# EAGLE design Science-Board (EAGLE 6.5.0)
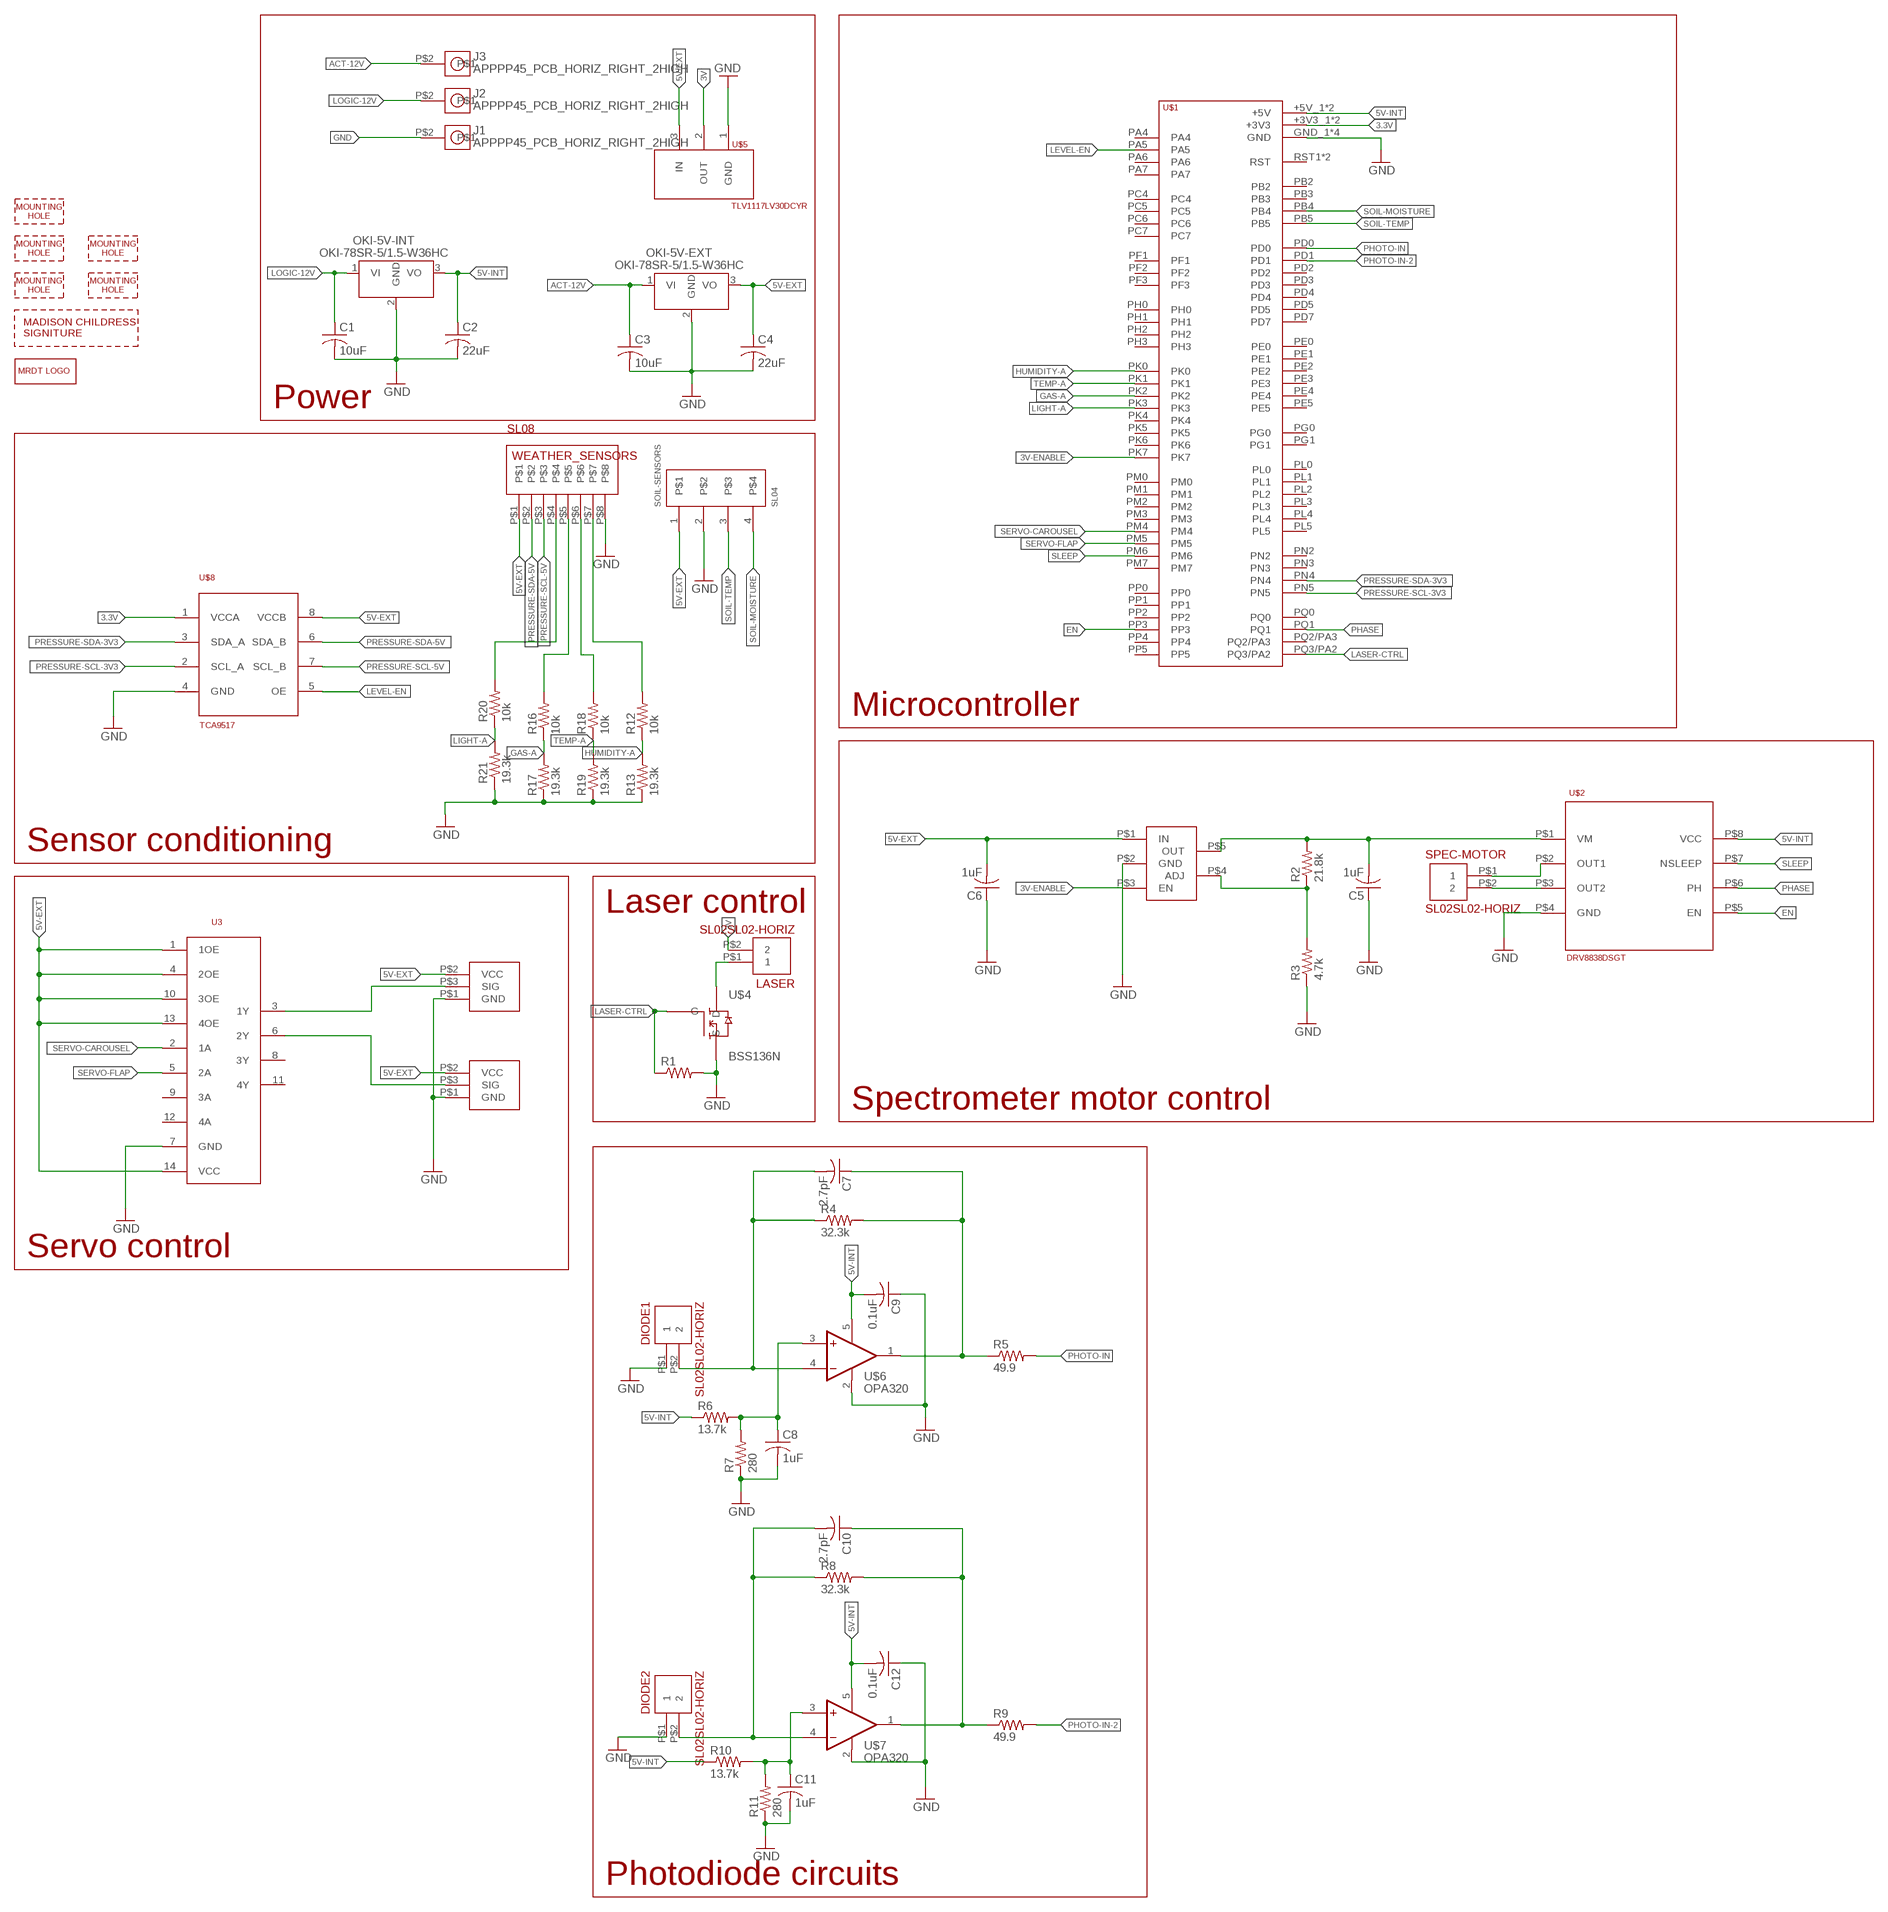
[diagram p0: schematic, sheet 1]

## Parts
C1  10uF  C-USC1206  [C1206]
C2  22uF  C-USC1206  [C1206]
C3  10uF  C-USC1206  [C1206]
C4  22uF  C-USC1206  [C1206]
C5  1uF  C-USC0805  [C0805]
C6  1uF  C-USC0805  [C0805]
C7  2.7pF  C-USC0805  [C0805]
C8  1uF  C-USC0805  [C0805]
C9  0.1uF  C-USC0805  [C0805]
C10  2.7pF  C-USC0805  [C0805]
C11  1uF  C-USC0805  [C0805]
C12  0.1uF  C-USC0805  [C0805]
CAROUSEL  SERVOHORIZ  [78208-103HLF]
DIODE1  SL02SL02-HORIZ  [MOLEX-70551-0001]
DIODE2  SL02SL02-HORIZ  [MOLEX-70551-0001]
FLAP  SERVOHORIZ  [78208-103HLF]
H1  MOUNTING_HOLE#6  [#6_SCREW]
H2  MOUNTING_HOLE#6  [#6_SCREW]
H3  MOUNTING_HOLE#6  [#6_SCREW]
H4  MOUNTING_HOLE#6  [#6_SCREW]
H5  MOUNTING_HOLE#6  [#6_SCREW]
J1  APPPP45_PCB_HORIZ_RIGHT_2HIGH  [APP45_PCB_HORIZ_RIGHT_2HIGH]
J2  APPPP45_PCB_HORIZ_RIGHT_2HIGH  [APP45_PCB_HORIZ_RIGHT_2HIGH]
J3  APPPP45_PCB_HORIZ_RIGHT_2HIGH  [APP45_PCB_HORIZ_RIGHT_2HIGH]
LASER  SL02SL02-HORIZ  [MOLEX-70551-0001]
LOGO1  MRDT_LOGO  [MRDT_LOGO]
OKI-5V-EXT  OKI-78SR-5/1.5-W36HC  [OKI-78SR_HORIZ]
OKI-5V-INT  OKI-78SR-5/1.5-W36HC  [OKI-78SR_HORIZ]
R1  R-US_M0805  [M0805]
R2  21.8k  R-US_M0805  [M0805]
R3  4.7k  R-US_M0805  [M0805]
R4  32.3k  R-US_M0805  [M0805]
R5  49.9  R-US_M0805  [M0805]
R6  13.7k  R-US_M0805  [M0805]
R7  280  R-US_M0805  [M0805]
R8  32.3k  R-US_M0805  [M0805]
R9  49.9  R-US_M0805  [M0805]
R10  13.7k  R-US_M0805  [M0805]
R11  280  R-US_M0805  [M0805]
R12  10k  R-US_R0805  [R0805]
R13  19.3k  R-US_R0805  [R0805]
R16  10k  R-US_R0805  [R0805]
R17  19.3k  R-US_R0805  [R0805]
R18  10k  R-US_R0805  [R0805]
R19  19.3k  R-US_R0805  [R0805]
R20  10k  R-US_R0805  [R0805]
R21  19.3k  R-US_R0805  [R0805]
SOIL-SENSORS  SL04  [MOLEX_SL_04_TH]
SPEC-MOTOR  SL02SL02-HORIZ  [MOLEX-70551-0001]
U3  SN74AHCT125  [SOIC14]
U$1  TIVA-1294  [TIVA-C-CONNECTED]
U$2  DRV8838DSGT  [8-WFDFN]
U$3  AP7365-WG-7DICT-ND  [SOT-25]
U$4  BSS136N  [PG-SOT23-3]
U$5  TLV1117LV30DCYR  [TO-243AA]
U$6  OPA320  [SOT-23-5]
U$7  OPA320  [SOT-23-5]
U$8  TCA9517  [SOIC8]
U$9  MADISON-CHILDRESS  [MADISON-CHLDRESS-SIG]
WEATHER_SENSORS  SL08  [MOLEX-70551-0007]

## Nets
3.3V: U$1.+3V3_1(+3V3) U$1.+3V3_2(+3V3) U$8.1(VCCA)
3V: LASER.P$2 U$5.2(OUT)
3V-ENABLE: U$1.PK7 U$3.P$3(EN)
5V-EXT: C4.1 C6.2 CAROUSEL.P$2(VCC) FLAP.P$2(VCC) OKI-5V-EXT.3(VO) SOIL-SENSORS.1 U3.1(1OE) U3.4(2OE) U3.10(3OE) U3.13(4OE) U3.14(VCC) U$3.P$1(IN) U$5.3(IN) U$8.8(VCCB) WEATHER_SENSORS.P$1
5V-INT: C2.1 C9.2 C12.2 OKI-5V-INT.3(VO) R6.1 R10.1 U$1.+5V_1(+5V) U$1.+5V_2(+5V) U$2.P$8(VCC) U$6.5(OFF1) U$7.5(OFF1)
ACT-12V: C3.1 J3.P$2 OKI-5V-EXT.1(VI)
EN: U$1.PP3 U$2.P$5(EN)
GAS-A: R16.1 R17.2 U$1.PK2
GND: C1.2 C2.2 C3.2 C4.2 C5.1 C6.1 C8.2 C9.1 C11.2 C12.1 CAROUSEL.P$1(GND) DIODE1.P$1 DIODE2.P$1 FLAP.P$1(GND) J1.P$2 OKI-5V-EXT.2(GND) OKI-5V-INT.2(GND) R1.2 R3.1 R7.1 R11.1 R13.1 R17.1 R19.1 R21.1 SOIL-SENSORS.2 U3.7(GND) U$1.GND_1(GND) U$1.GND_2(GND) U$1.GND_3(GND) U$1.GND_4(GND) U$2.P$4(GND) U$3.P$2(GND) U$4.P$2(S) U$5.1(GND) U$6.2(OFF2) U$7.2(OFF2) U$8.4(GND) WEATHER_SENSORS.P$8
HUMIDITY-A: R12.1 R13.2 U$1.PK0
LASER-CTRL: R1.1 U$1.PQ3/PA2 U$4.P$3(G)
LEVEL-EN: U$1.PA5 U$8.5(OE)
LIGHT-A: R20.1 R21.2 U$1.PK3
LOGIC-12V: C1.1 J2.P$2 OKI-5V-INT.1(VI)
N$1: SPEC-MOTOR.P$1 U$2.P$2(OUT1)
N$2: SPEC-MOTOR.P$2 U$2.P$3(OUT2)
N$3: LASER.P$1 U$4.P$1(D)
N$4: C7.2 DIODE1.P$2 R4.1 U$6.4(-IN)
N$5: C5.2 R2.2 U$2.P$1(VM) U$3.P$5(OUT)
N$7: R12.2 WEATHER_SENSORS.P$7
N$8: C7.1 R4.2 R5.1 U$6.1(OUT)
N$9: C10.2 DIODE2.P$2 R8.1 U$7.4(-IN)
N$10: C8.1 R6.2 R7.2 U$6.3(+IN)
N$11: CAROUSEL.P$3(SIG) U3.3(1Y)
N$12: FLAP.P$3(SIG) U3.6(2Y)
N$13: C10.1 R8.2 R9.1 U$7.1(OUT)
N$14: C11.1 R10.2 R11.2 U$7.3(+IN)
N$15: R20.2 WEATHER_SENSORS.P$4
N$16: R18.2 WEATHER_SENSORS.P$6
N$17: R16.2 WEATHER_SENSORS.P$5
N$18: R2.1 R3.2 U$3.P$4(ADJ)
PHASE: U$1.PQ1 U$2.P$6(PH)
PHOTO-IN: R5.2 U$1.PD0
PHOTO-IN-2: R9.2 U$1.PD1
PRESSURE-SCL-3V3: U$1.PN5 U$8.2(SCL_A)
PRESSURE-SCL-5V: U$8.7(SCL_B) WEATHER_SENSORS.P$3
PRESSURE-SDA-3V3: U$1.PN4 U$8.3(SDA_A)
PRESSURE-SDA-5V: U$8.6(SDA_B) WEATHER_SENSORS.P$2
SERVO-CAROUSEL: U3.2(1A) U$1.PM4
SERVO-FLAP: U3.5(2A) U$1.PM5
SLEEP: U$1.PM6 U$2.P$7(NSLEEP)
SOIL-MOISTURE: SOIL-SENSORS.4 U$1.PB4
SOIL-TEMP: SOIL-SENSORS.3 U$1.PB5
TEMP-A: R18.1 R19.2 U$1.PK1
Unconnected: U3.8(3Y) U3.9(3A) U3.11(4Y) U3.12(4A) U$1.PA4 U$1.PA6 U$1.PA7 U$1.PB2 U$1.PB3 U$1.PC4 U$1.PC5 U$1.PC6 U$1.PC7 U$1.PD2 U$1.PD3 U$1.PD4 U$1.PD5 U$1.PD7 U$1.PE0 U$1.PE1 U$1.PE2 U$1.PE3 U$1.PE4 U$1.PE5 U$1.PF1 U$1.PF2 U$1.PF3 U$1.PG0 U$1.PG1 U$1.PH0 U$1.PH1 U$1.PH2 U$1.PH3 U$1.PK4 U$1.PK5 U$1.PK6 U$1.PL0 U$1.PL1 U$1.PL2 U$1.PL3 U$1.PL4 U$1.PL5 U$1.PM0 U$1.PM1 U$1.PM2 U$1.PM3 U$1.PM7 U$1.PN2 U$1.PN3 U$1.PP0 U$1.PP1 U$1.PP2 U$1.PP4 U$1.PP5 U$1.PQ0 U$1.PQ2/PA3 U$1.RST1(RST) U$1.RST_2(RST)

## Notes on the sheet
- Power
- Microcontroller
- Sensor conditioning
- Laser control
- Spectrometer motor control
- Servo control
- Photodiode circuits

## Library data of the parts
C1-C12 = rcl:C-US: CAPACITOR, American symbol
CAROUSEL FLAP = MRDT-Connectors:SERVO
DIODE1 DIODE2 LASER SPEC-MOTOR = MRDT-Connectors:SL02
H1-H5 = MRDT-Hardware:MOUNTING_HOLE: Mounting hole for M6 bolt. Standard use mounting hole for: Tiva C Connected - M6 Anderson Powerpole Mounting Wing - M8 Most frame-mounted PCB's - M8
J1-J3 = MRDT-Connectors:APP: http://www.powerwerx.com/anderson-powerpoles/
LOGO1 = MRDT-Hardware:MRDT_LOGO
OKI-5V-EXT OKI-5V-INT = MRDT-ICs:OKI-78SR-*/1.5-W36?C: 4.95W DC/DC Converter Manufacturer: Murata; VOUT: +5v
R1-R13 R16-R21 = rcl:R-US_: RESISTOR, American symbol
SOIL-SENSORS = MRDT-Connectors:SL04
U3 = MRDT-ICs:SN74AHCT125: part # SN74AHCT125 QUADRUPLE BUS BUFFER GATES WITH 3-STATE OUTPUTS http://www.digikey.com/product-detail/en/SN74AHCT125DR/296-4652-1-ND/405208; PARTNO: SN74AHCT125
U$1 = MRDT-Microcontrollers:TIVA-1294: TIVA C CONNECTED LAUNCHPAD
U$2 = MRDT-ICs:DRV8838DSGT
U$3 = MRDT-ICs:AP7365-WG-7DICT-ND: Linear Voltage Regulator IC Positive Adjustable 1 Output 0.8 V ~ 5 V 600mA SOT-25-5
U$4 = MRDT-Semiconductors:BSS136N: MOSFET-N-CH 30V 1.4A SOT23
U$5 = MRDT-ICs:TLV1117LV30DCYR: Linear Voltage Regulator IC Positive Fixed 1 Output 3V 1A SOT-223-4
U$6 U$7 = MRDT-ICs:OPA320
U$8 = MRDT-ICs:TCA9517: TCA9517 Level-Shifting I2C Bus Repeater
U$9 = sig:MADISON-CHILDRESS
WEATHER_SENSORS = MRDT-Connectors:SL08

## Board
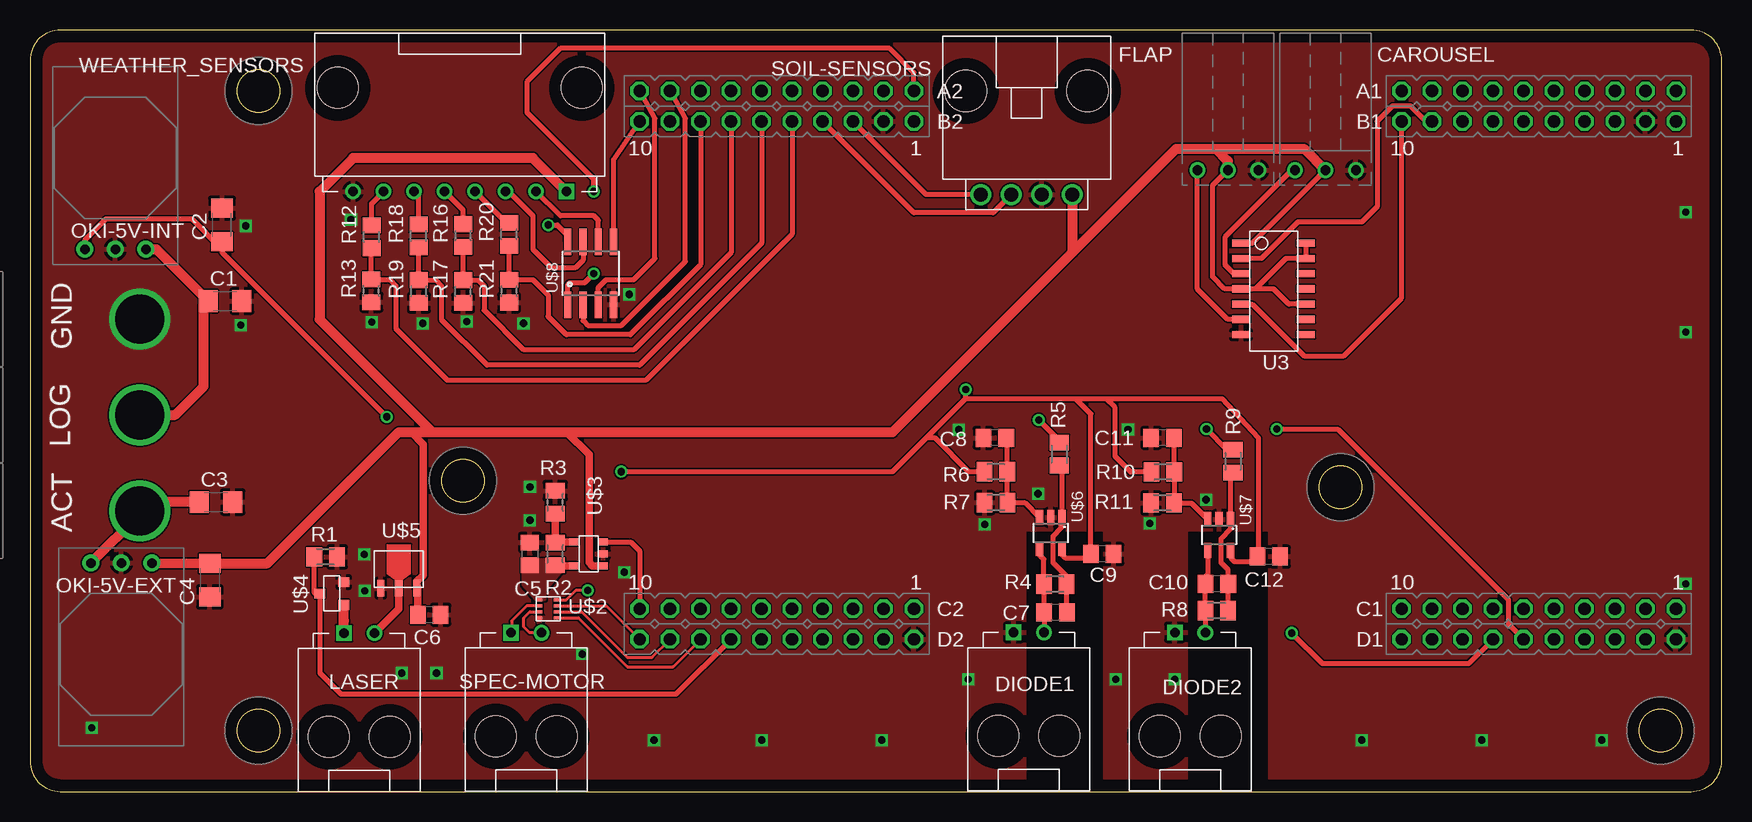
[diagram p1: board, top side]
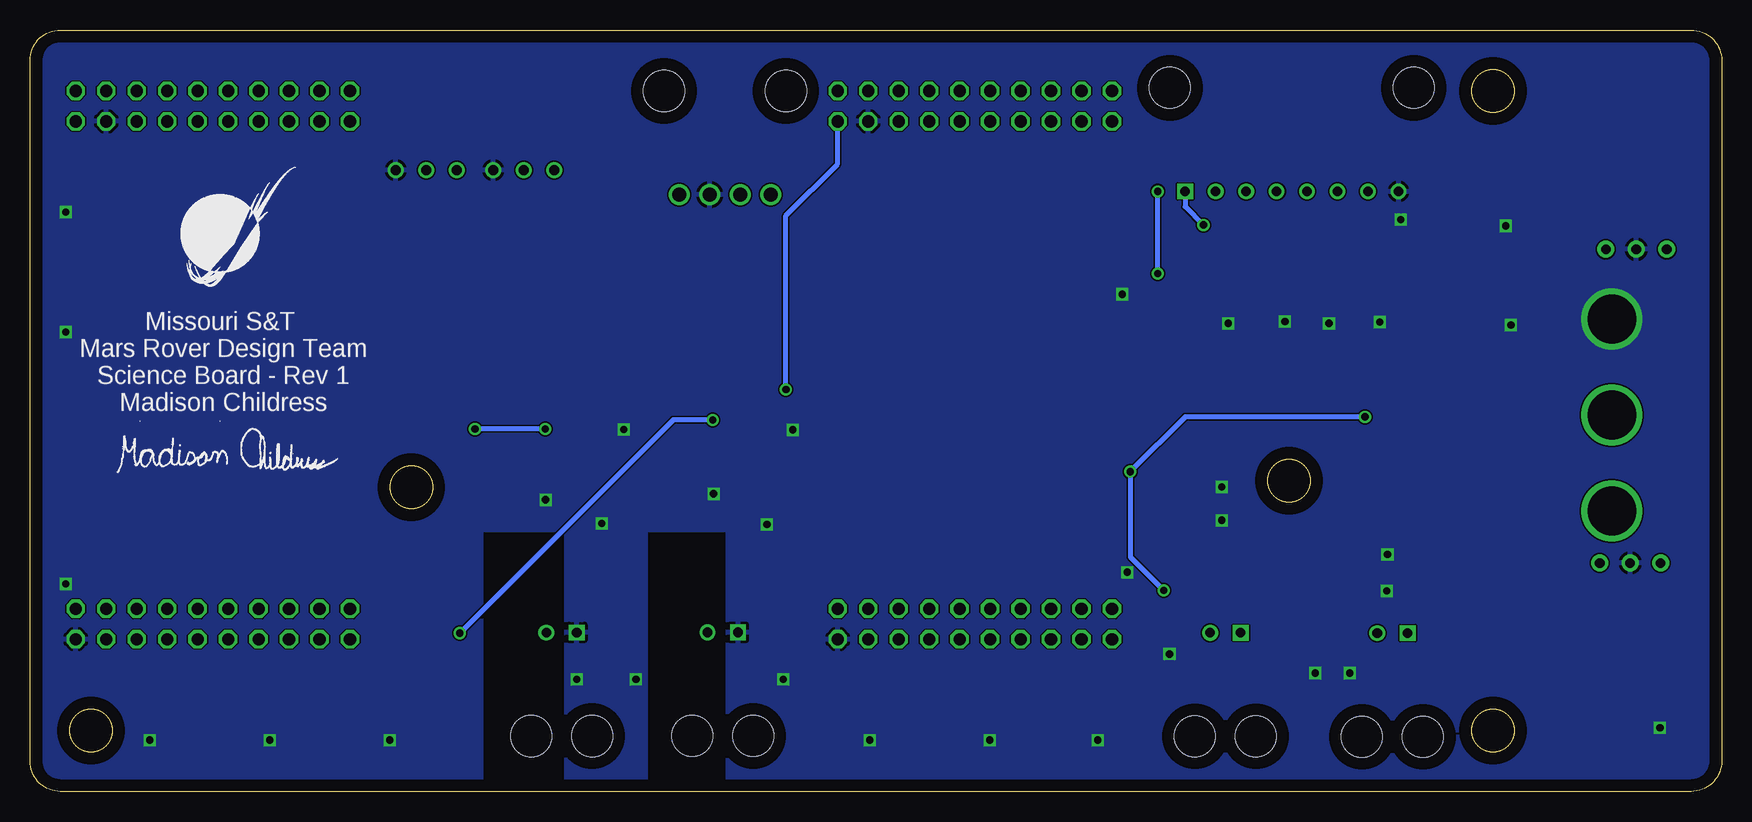
[diagram p2: board, bottom side, seen from below]

Size 140.97 x 63.5 mm. Coordinates in mm from the lower left corner, seen from the top.
Outline: 0,2.54 arc90 2.54,0 138.43,0 arc90 140.97,2.54 140.97,60.96 arc90 138.43,63.5 2.54,63.5 arc90 0,60.96 0,2.54
Copper layers (1*16): Top 0.035mm / dielectric 1.5mm / Bottom 0.035mm
Design rules "advanced_circuits_standard": minimum track width 5mil, minimum drill 10mil, track to track 5mil, track to pad 5mil, pad to pad 5mil, via to via 5mil, smd to smd 5mil, copper to edge 40mil, drill to drill 5mil, minimum pad ring 10mil, minimum via ring 8mil, stop-mask expansion 4mil, vias tented up to drill 0mil, thermal gap 10mil

### Footprints (pad centres in the part's own frame; a part is rotated, then mirrored left to right if it is on the bottom)
C1206 = smd 1.6 x 1.8: 1 -1.4,0; 2 1.4,0
C0805 = smd 1.3 x 1.5: 1 -0.95,0; 2 0.95,0
78208-103HLF = drill 0.8: P$1 2.54,0; P$2 0,0; P$3 -2.54,0
MOLEX-70551-0001 = drill 0.8 square: P$1 1.27,0 | drill 0.8: P$2 -1.27,0 | hole 3.404: 2.54,8.636; -2.54,8.636
APP45_PCB_HORIZ_RIGHT_2HIGH = drill 4.064: P$2 36.068,3.969
OKI-78SR_HORIZ = drill 0.8 pad 1.422: 1 0,0; 2 -2.54,0; 3 -5.08,0
M0805 = smd 1.3 x 1.6: 1 -0.95,0; 2 0.95,0
R0805 = smd 1.3 x 1.5: 1 -0.95,0; 2 0.95,0
MOLEX_SL_04_TH = drill 1.168: 1 3.81,0; 2 1.27,0; 3 -1.27,0; 4 -3.81,0 | hole 3.454: -5.08,8.636; 5.08,8.636
SOIC14 = smd 1.5 x 0.6: 1 1.11,10.16; 2 1.11,8.89; 3 1.11,7.62; 4 1.11,6.35; 5 1.11,5.08; 6 1.11,3.81; 7 1.11,2.54; 8 6.51,2.54; 9 6.51,3.81; 10 6.51,5.08; 11 6.51,6.35; 12 6.51,7.62; 13 6.51,8.89; 14 6.51,10.16
TIVA-C-CONNECTED = drill 1.016 octagon: +3V3_1 59.69,54.61; +3V3_2 123.19,54.61; +5V_1 59.69,52.07; +5V_2 123.19,52.07; GND_1 57.15,52.07; GND_2 59.69,8.89; GND_3 120.65,52.07; GND_4 123.19,8.89; PA4 39.37,52.07; PA5 36.83,52.07; PA6 105.41,52.07; PA7 52.07,8.89; PB2 102.87,54.61; PB3 100.33,54.61; PB4 54.61,52.07; PB5 52.07,52.07; PC4 118.11,54.61; PC5 115.57,54.61; PC6 113.03,54.61; PC7 105.41,54.61; PD0 107.95,8.89; PD1 110.49,8.89; PD2 57.15,54.61; PD3 107.95,54.61; PD4 49.53,54.61; PD5 46.99,54.61; PD7 107.95,52.07; PE0 118.11,52.07; PE1 115.57,52.07; PE2 113.03,52.07; PE3 110.49,52.07; PE4 120.65,54.61; PE5 110.49,54.61; PF1 123.19,11.43; PF2 120.65,11.43; PF3 118.11,11.43; PG0 115.57,11.43; PG1 59.69,11.43; PH0 44.45,11.43; PH1 41.91,11.43; PH2 118.11,8.89; PH3 115.57,8.89; PK0 49.53,52.07; PK1 46.99,52.07; PK2 44.45,52.07; PK3 41.91,52.07; PK4 57.15,11.43; PK5 54.61,11.43; PK6 39.37,11.43; PK7 36.83,11.43; PL0 107.95,11.43; PL1 105.41,11.43; PL2 102.87,11.43; PL3 100.33,11.43; PL4 113.03,11.43; PL5 110.49,11.43; PM0 52.07,11.43; PM1 49.53,11.43; PM2 46.99,11.43; PM3 120.65,8.89; PM4 102.87,52.07; PM5 100.33,52.07; PM6 36.83,8.89; PM7 57.15,8.89; PN2 105.41,8.89; PN3 102.87,8.89; PN4 36.83,54.61; PN5 39.37,54.61; PP0 54.61,54.61; PP1 52.07,54.61; PP2 100.33,8.89; PP3 41.91,8.89; PP4 41.91,54.61; PP5 54.61,8.89; PQ0 44.45,54.61; PQ1 39.37,8.89; PQ2/PA3 46.99,8.89; PQ3/PA2 44.45,8.89; RST1 49.53,8.89; RST_2 113.03,8.89
8-WFDFN = smd 0.25 x 0.5: P$1 0.75,0.725; P$2 0.25,0.725; P$3 -0.25,0.725; P$4 -0.75,0.725; P$5 -0.75,-0.725; P$6 -0.25,-0.725; P$7 0.25,-0.725; P$8 0.75,-0.725
SOT-25 = smd 0.55 x 0.8: P$1 1,1.2; P$2 0,1.2; P$3 -1,1.2; P$4 -1,-1.2; P$5 1,-1.2
PG-SOT23-3 = smd 0.8 x 0.9: P$1 -0.95,-1; P$2 0.95,-1; P$3 0,1
TO-243AA = smd 0.57 x 1.4: 1 -1.5,0.7; 3 1.5,0.7 | smd 0.635 x 1.27: 2 0,0.7
SOT-23-5 = smd 0.62 x 1.22: 1 -0.95,-1.3; 2 0,-1.3; 3 0.95,-1.3; 4 0.95,1.3; 5 -0.95,1.3
SOIC8 = smd 0.6 x 2.2: 1 0.457,-0.813; 2 1.727,-0.813; 3 2.997,-0.813; 4 4.267,-0.813; 5 4.267,4.419; 6 2.997,4.419; 7 1.727,4.419; 8 0.457,4.419
MOLEX-70551-0007 = drill 0.8 square: P$1 8.89,0 | drill 0.8: P$2 6.35,0; P$3 3.81,0; P$4 1.27,0; P$5 -1.27,0; P$6 -3.81,0; P$7 -6.35,0; P$8 -8.89,0 | hole 3.404: 10.16,8.636; -10.16,8.636

### Placement (x,y rotation side)
C1  16.26,40.89 0 top
C2  16,47.24 90 top
C3  15.49,24.13 0 top
C4  14.99,17.63 270 top
C5  41.66,19.81 270 top
C6  33.27,14.73 180 top
C7  85.46,14.92 180 top
C8  80.4,29.5 180 top
C9  89.35,19.8 180 top
C10  98.9,17.32 180 top
C11  94.38,29.49 180 top
C12  103.23,19.6 180 top
CAROUSEL  107.95,51.82 0 top
DIODE1  83.24,13.27 180 top
DIODE2  96.67,13.26 180 top
FLAP  99.82,51.82 0 top
H1  19.05,5.08 0 top
H2  135.89,5.08 0 top
H3  19.05,58.42 0 top
H4  109.19,25.37 0 top
H5  36.07,25.91 0 top
J1  -26.92,35.43 0 top
J2  -26.92,27.43 0 top
J3  -26.92,19.43 0 top
LASER  27.43,13.21 180 top
LOGO1  128.43,41.26 0 bottom
OKI-5V-EXT  5.08,19.05 180 top
OKI-5V-INT  9.65,45.21 0 top
R1  24.64,19.56 0 top
R2  43.76,19.81 270 top
R3  43.76,24.13 270 top
R4  85.43,17.29 0 top
R5  85.77,28.14 90 top
R6  80.48,26.66 0 top
R7  80.5,24.08 0 top
R8  98.9,15.09 0 top
R9  100.26,27.54 90 top
R10  94.41,26.64 0 top
R11  94.38,24.06 0 top
R12  28.46,46.26 90 top
R13  28.44,41.75 90 top
R16  36.1,46.36 90 top
R17  36.09,41.69 90 top
R18  32.38,46.33 90 top
R19  32.4,41.7 90 top
R20  39.92,46.46 90 top
R21  39.93,41.72 90 top
SOIL-SENSORS  83.06,49.78 0 top
SPEC-MOTOR  41.35,13.23 180 top
U3  99.82,35.56 0 top
U$1  13.97,3.81 0 top
U$2  43.18,15.24 90 top
U$3  46.56,19.81 270 top
U$4  25.15,16.51 90 top
U$5  30.73,16.26 0 top
U$6  85.06,21.56 180 top
U$7  99.09,21.41 180 top
U$8  44.36,41.41 0 top
U$9  134.78,25.67 0 bottom
WEATHER_SENSORS  35.81,50.04 0 top

### Tracks (layer width: path | path; a pad name or v marks a point on that pad's centre or on a via)
3.3V  (via drill 0.6)
  Top 0.406: U$1.+3V3_1 73.66,59.94 71.63,61.98 44.2,61.98 41.4,59.18 41.4,56.64 46.99,51.05 v46.99,50.04 | U$8.1 44.82,42.28 44.96,42.42 46.23,42.42 v46.99,43.18
  Bottom 0.406: v46.99,43.18 v46.99,50.04
3V
  Top 0.61: U$5.2 30.73,15.24 LASER.P$2
3V-ENABLE
  Top 0.406: U$3.P$3 50.05,20.81 50.8,20.07 U$1.PK7
5V-EXT  (via drill 0.6)
  Top 0.406: U3.14 U3.13 104.65,44.45 102.11,41.91 | U3.1 101.85,45.72 CAROUSEL.P$2 | FLAP.P$2 98.55,50.55 98.55,42.93 99.57,41.91 U3.4 102.11,41.91 | U3.10 104.9,40.64 103.63,41.91 102.11,41.91 | v43.18,47.24 43.94,47.24 44.7,46.48 44.7,45.95 U$8.8
  Top 0.61: C6.2 32.3,17.02 U$5.3 32.23,17.5 32.77,18.03 32.77,28.96 31.75,29.97 | U$3.P$1 46.87,18.81 46.58,19.1 46.58,28.09 44.7,29.97
  Top 0.813: OKI-5V-EXT.3 C4.1 19.79,19.03 30.73,29.97 31.75,29.97 33.53,29.97 | 86.87,44.96 71.88,29.97 44.7,29.97 33.53,29.97 | 86.87,44.96 95.5,53.59 98.81,53.59 | 98.81,53.59 106.17,53.59 CAROUSEL.P$2 | FLAP.P$2 99.82,52.58 98.81,53.59 | SOIL-SENSORS.1 86.87,44.96 | WEATHER_SENSORS.P$1 41.91,52.83 26.92,52.83 24.13,50.04 24.13,39.37 33.53,29.97
  Bottom 0.406: WEATHER_SENSORS.P$1 44.7,48.77 v43.18,47.24
5V-INT  (via drill 0.6)
  Top 0.254: v46.48,16.76 45.47,16.76 44.69,15.99 U$2.P$8
  Top 0.406: U$7.5 100.04,19.5 100.36,19.18 102.19,19.18 C12.2 102.36,19.94 102.36,29.46 99.31,32.77 89.66,32.77 | U$6.5 86.01,19.73 86.26,19.48 88.08,19.48 C9.2 88.4,31.49 87.12,32.77 | OKI-5V-INT.3 4.57,45.97 6.35,47.75 13.46,47.75 15.75,45.47 15.75,45.59 C2.1 16,44.96 v29.72,31.24 | v49.28,26.67 71.88,26.67 74.68,29.46 | 74.68,29.46 77.98,32.77 | 77.98,32.77 87.12,32.77 | 87.12,32.77 89.66,32.77 | R10.1 91.72,26.64 90.42,27.94 90.42,32 89.66,32.77 | R6.1 78.24,26.66 75.44,29.46 74.68,29.46 | 77.98,32.77 v77.98,33.53
  Bottom 0.406: v46.48,16.76 49.28,19.56 v49.28,26.67 44.7,31.24 v29.72,31.24 | v77.98,33.53 77.98,48.01 73.66,52.32 U$1.+5V_1
ACT-12V
  Top 0.813: OKI-5V-EXT.1 9.14,23.11 J3.P$2 9.87,24.13 C3.1
EN
  Top 0.254: U$2.P$5 45.71,14.49 49.78,10.41 53.59,10.41 U$1.PP3
GAS-A
  Top 0.406: U$1.PK2 58.42,44.96 50.29,36.83 41.15,36.83 37.85,40.13 37.85,42.16 37.37,42.64 R17.2 36.09,45.4 R16.1
GND  (via drill 0.6)
  other vias: 41.13,39.04 32.72,39.04 36.39,39.19 28.48,39.14 49.94,41.46 49.53,18.29 27.91,16.73 5.14,5.3 27.84,19.78 30.98,9.87 33.87,9.87 52,4.29 60.98,4.29 70.98,4.29 78.19,9.37 90.48,9.37 95.4,9.37 110.98,4.29 120.98,4.29 130.98,4.29 91.5,30.19 137.98,17.3 137.98,38.3 137.98,48.3 26.75,47.69 98,24.33 84,24.83 93.31,22.35 79.56,22.28 46.01,11.46 41.66,22.62 41.66,25.39 77.4,30.16 17.56,38.89 17.99,47.16
  pour Top (rank 2): -2.79,70.36 153.67,70.36 154.18,-3.56 103.38,-3.56 103.38,21.84 96.27,21.84 96.27,-3.81 89.66,-3.81 89.66,21.84 82.8,21.84 82.8,-4.06 -2.29,-4.06
  pour Bottom (rank 2): -2.29,71.12 157.99,71.37 157.99,-3.3 103.38,-3.56 103.38,21.84 96.27,21.84 96.27,-3.81 89.66,-3.81 89.66,21.84 82.8,21.84 82.8,-4.06 -2.29,-4.06
HUMIDITY-A
  Top 0.406: U$1.PK0 63.5,46.48 51.31,34.29 34.8,34.29 30.48,38.61 30.48,42.16 29.97,42.67 28.98,42.67 R13.2 28.44,45.29 R12.1
LASER-CTRL
  Top 0.406: R1.1 23.69,16.56 U$4.P$3 24.15,9.89 25.91,8.13 53.85,8.13 U$1.PQ3/PA2
LEVEL-EN
  Top 0.406: U$8.5 48.63,52.69 U$1.PA5
LIGHT-A
  Top 0.406: U$1.PK3 55.88,43.94 50.04,38.1 44.7,38.1 43.18,39.62 43.18,41.4 41.91,42.67 R21.2 39.93,45.49 R20.1
LOGIC-12V
  Top 0.813: J2.P$2 12.1,31.4 14.48,33.78 14.48,40.52 C1.1 10.54,45.21 OKI-5V-INT.1
N$1
  Top 0.254: U$2.P$2 41.4,15.49 40.13,14.22 40.13,13.28 SPEC-MOTOR.P$1
N$2
  Top 0.254: SPEC-MOTOR.P$2 41.63,13.23 41.15,13.72 41.15,14.48 41.66,14.99 U$2.P$3
N$3
  Top 0.813: LASER.P$1 26.15,14.24 U$4.P$1
N$4
  Top 0.406: U$6.4 84.16,20.22 84.16,19.68 84.48,19.36 R4.1 84.51,17.26 C7.2 DIODE1.P$2
N$5
  Top 0.61: U$3.P$5 43.81,18.81 R2.2
  pour Top (no thermals): 44.2,19.3 41.05,19.3 41.05,17.27 42.16,16 42.93,16 42.93,16.76 44.2,18.29
N$7
  Top 0.406: R12.2 28.46,49.04 WEATHER_SENSORS.P$7
N$8
  Top 0.406: C7.1 86.41,17.26 R4.2 86.38,17.96 85.26,19.08 85.26,21.28 85.96,21.98 85.96,22.8 U$6.1 86.01,26.95 R5.1
N$9
  Top 0.406: 97.95,17.92 R8.1 97.95,13.39 DIODE2.P$2 | 97.95,17.92 C10.2 | U$7.4 98.14,18.12 97.95,17.92
N$10
  Top 0.406: C8.1 81.43,29.41 R6.2 81.45,26.64 R7.2 82.89,24.08 U$6.3
N$11
  Top 0.406: U3.3 100.33,43.18 99.57,43.94 99.57,46.23 105.16,51.82 CAROUSEL.P$3
N$12
  Top 0.406: U3.6 99.82,39.37 97.28,41.91 FLAP.P$3
N$13
  Top 0.406: R8.2 99.85,17.92 C10.1 99.85,18.49 99.26,19.08 99.26,21.08 100.06,21.88 100.06,22.69 U$7.1 100.04,26.38 R9.1
N$14
  Top 0.406: C11.1 95.33,26.68 R10.2 95.36,24.09 R11.2 96.79,24.06 U$7.3
N$15
  Top 0.406: R20.2 39.71,47.41 WEATHER_SENSORS.P$4
N$16
  Top 0.406: R18.2 32.38,49.66 WEATHER_SENSORS.P$6
N$17
  Top 0.406: R16.2 36.1,48.48 WEATHER_SENSORS.P$5
N$18
  Top 0.61: U$3.P$4 43.81,20.81 R2.1 R3.2
PHASE
  Top 0.254: U$2.P$6 45.97,14.99 49.78,11.18 51.82,11.18 U$1.PQ1
PHOTO-IN  (via drill 0.6)
  Top 0.406: R5.2 85.77,29.29 v84.07,30.99 | v105.16,13.21 107.7,10.67 119.89,10.67 U$1.PD0
  Bottom 0.406: v84.07,30.99 87.38,30.99 v105.16,13.21
PHOTO-IN-2  (via drill 0.6)
  Top 0.406: R9.2 99.78,28.49 v98.04,30.23 | v103.89,30.23 108.97,30.23 123.19,16 123.19,13.97 U$1.PD1
  Bottom 0.406: v98.04,30.23 v103.89,30.23
PRESSURE-SCL-3V3
  Top 0.406: U$8.2 46.09,39.26 46.48,38.86 49.28,38.86 54.61,44.2 54.61,56.13 U$1.PN5
PRESSURE-SCL-5V
  Top 0.406: WEATHER_SENSORS.P$3 39.88,50.04 41.91,48.01 41.91,45.21 43.43,43.69 45.47,43.69 46.09,44.31 U$8.7
PRESSURE-SDA-3V3
  Top 0.406: U$8.3 47.36,42.02 48.01,42.67 50.29,42.67 52.07,44.45 52.07,56.13 U$1.PN4
PRESSURE-SDA-5V
  Top 0.406: U$8.6 47.36,47.64 46.99,48.01 44.2,48.01 WEATHER_SENSORS.P$2
SERVO-CAROUSEL
  Top 0.406: U$1.PM4 116.33,55.88 115.06,57.15 113.54,57.15 112.27,55.88 112.27,48.77 111,47.5 105.66,47.5 102.62,44.45 U3.2
SERVO-FLAP
  Top 0.406: U3.5 101.85,40.64 106.17,36.32 109.47,36.32 114.3,41.15 U$1.PM5
SLEEP
  Top 0.254: U$2.P$7 48.01,15.49 U$1.PM6
SOIL-MOISTURE
  Top 0.406: SOIL-SENSORS.4 74.68,49.78 U$1.PB4
SOIL-TEMP
  Top 0.406: SOIL-SENSORS.3 80.26,48.26 73.66,48.26 U$1.PB5
TEMP-A
  Top 0.406: U$1.PK1 60.96,45.72 50.8,35.56 38.1,35.56 34.29,39.37 34.29,42.16 33.81,42.65 R19.2 32.4,45.37 R18.1

### Text on the board
tNames: GND | LOG | ACT
bNames: Missouri S&T / Mars Rover Design Team / Science Board - Rev 1 / Madison Childress